# Altium schematic sheet nrf_ha_sensor_Top.SchDoc: PCA70107 Top
size A4; DocumentNumber: 1; Revision: 0; SheetNumber: 1; SheetTotal: 4; ProjectNumber: <Project number>; DocumentSize: A4; PCBRevision: <PCB designer code>
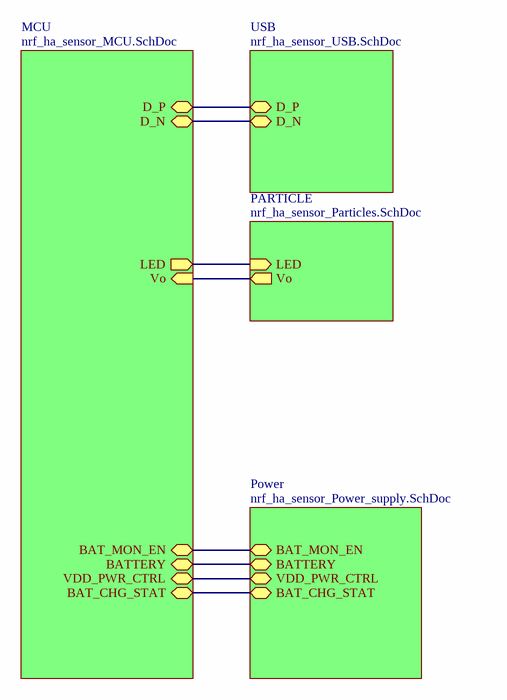
[diagram p0: nrf_ha_sensor_Top.SchDoc]

## Sub-sheets
MCU = nrf_ha_sensor_MCU.SchDoc: BATTERY (bidir), BAT_MON_EN (bidir), BAT_CHG_STAT (bidir), VDD_PWR_CTRL (bidir), D_P (bidir), D_N (bidir), LED (out), Vo (in)
PARTICLE = nrf_ha_sensor_Particles.SchDoc: Vo (out), LED (in)
Power = nrf_ha_sensor_Power_supply.SchDoc: BAT_MON_EN (bidir), BATTERY (bidir), VDD_PWR_CTRL (bidir), BAT_CHG_STAT (bidir)
USB = nrf_ha_sensor_USB.SchDoc: D_P (bidir), D_N (bidir)

## Nets
(unnamed): sheet MCU/BATTERY, sheet Power/BATTERY
(unnamed): sheet MCU/BAT_MON_EN, sheet Power/BAT_MON_EN
(unnamed): sheet MCU/BAT_CHG_STAT, sheet Power/BAT_CHG_STAT
(unnamed): sheet MCU/VDD_PWR_CTRL, sheet Power/VDD_PWR_CTRL
(unnamed): sheet MCU/D_P, sheet USB/D_P
(unnamed): sheet MCU/D_N, sheet USB/D_N
(unnamed): sheet MCU/LED, sheet PARTICLE/LED
(unnamed): sheet MCU/Vo, sheet PARTICLE/Vo

## Notes on the sheet
- Title
- Size
- Date:
- Project Number
- Sheet         of
- Revision
- File:
- Drawn By: